# EAGLE design zumo_uni_i2c_01 (EAGLE 9.5.2)
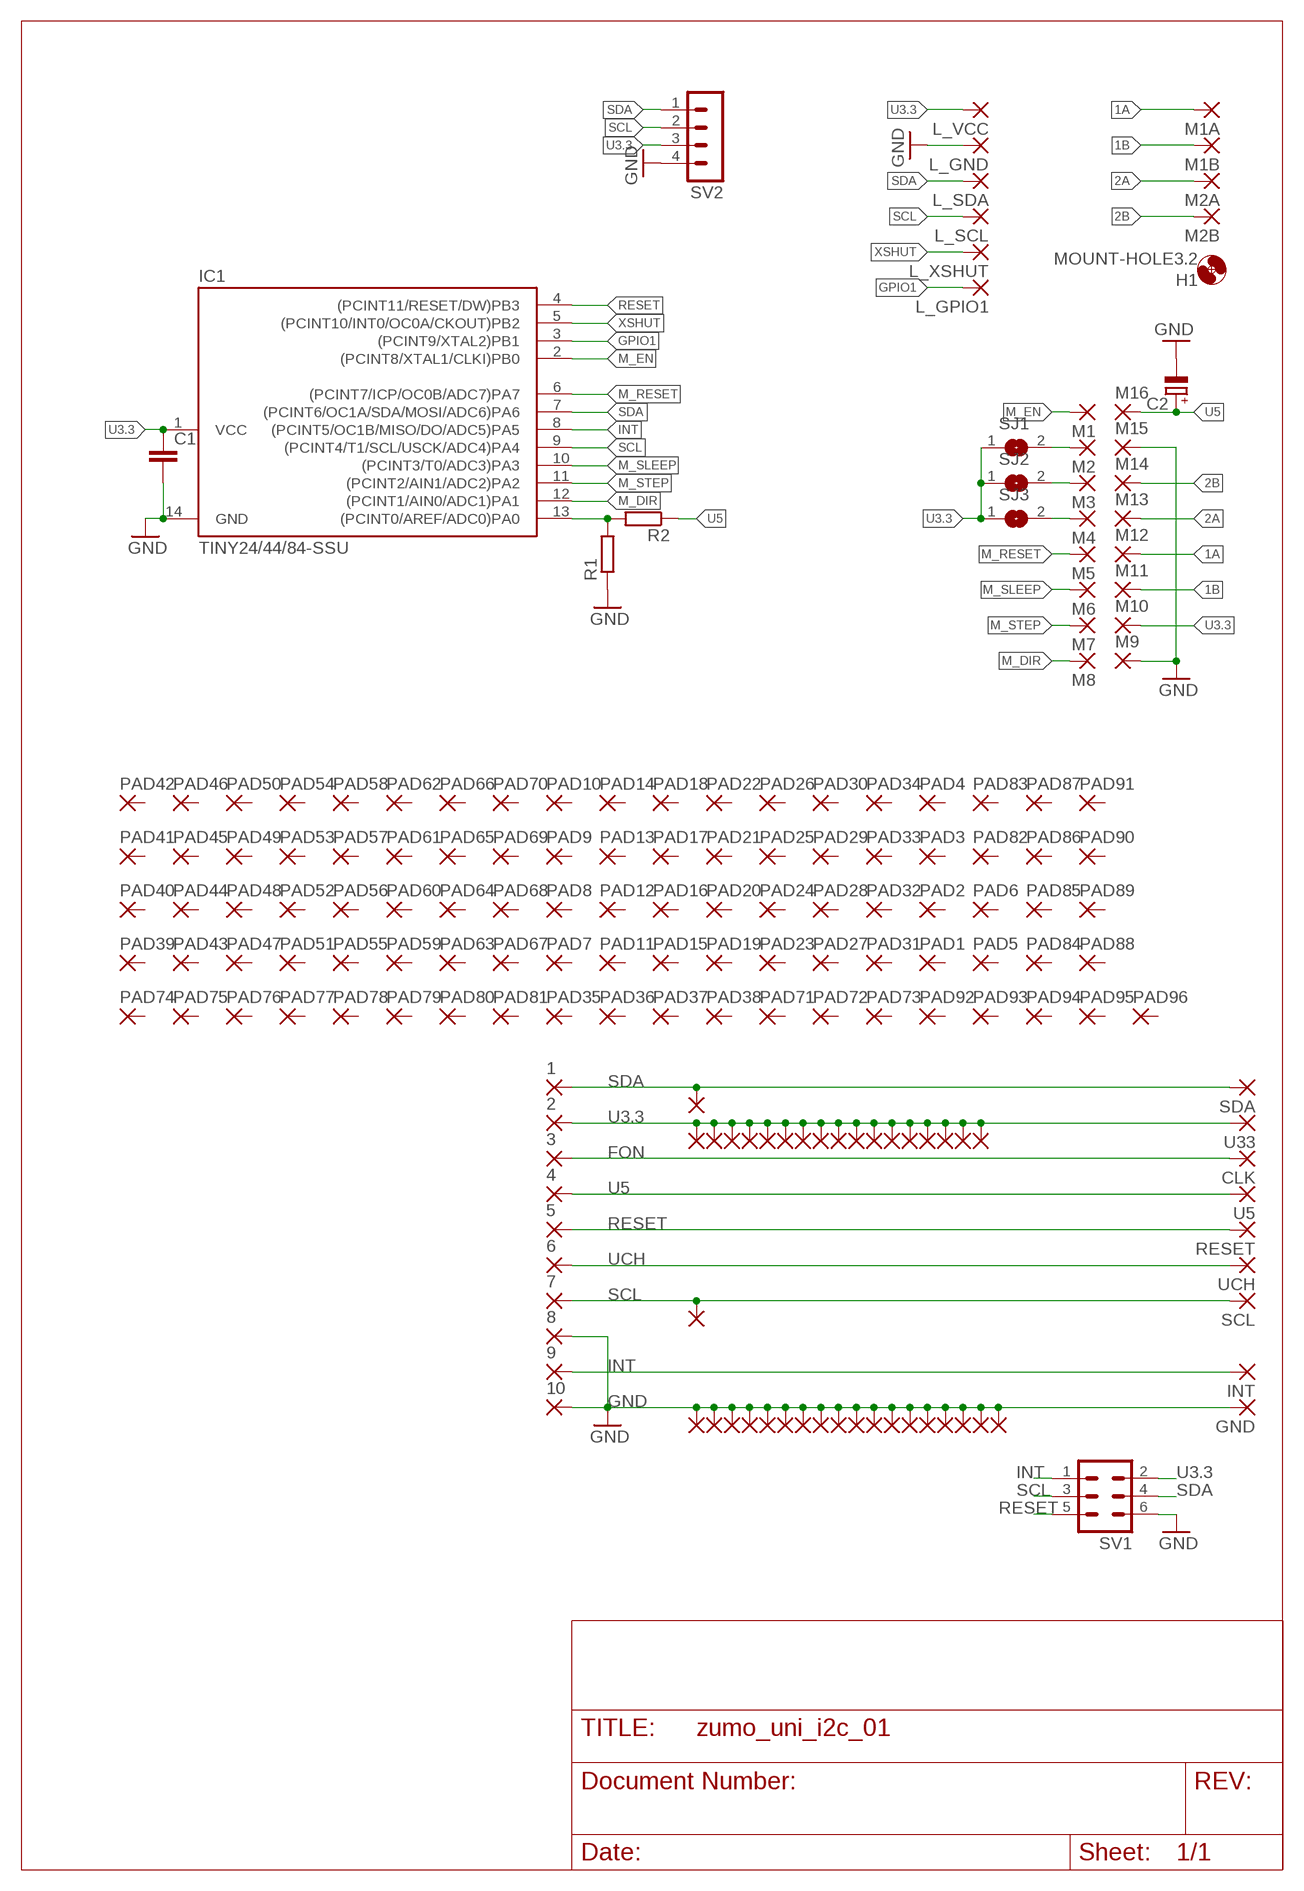
[diagram p0: schematic, sheet 1]

## Parts
1  SMD2  [SMD1,27-2,54]
2  SMD2  [SMD1,27-2,54]
3  SMD2  [SMD1,27-2,54]
4  SMD2  [SMD1,27-2,54]
5  SMD2  [SMD1,27-2,54]
6  SMD2  [SMD1,27-2,54]
7  SMD2  [SMD1,27-2,54]
8  SMD2  [SMD1,27-2,54]
9  SMD2  [SMD1,27-2,54]
10  SMD2  [SMD1,27-2,54]
C1  C-EUC0805  [C0805]
C2  CPOL-EUSMCC  [SMC_C]
CLK  1,6/0,9  [1,6/0,9]
GND  1,6/0,9  [1,6/0,9]
H1  MOUNT-HOLE3.2  [3,2]
IC1  TINY24/44/84-SSU  [SOIC14]
INT  1,6/0,9  [1,6/0,9]
L_GND  1,6/0,8  [1,6/0,8]
L_GPIO1  1,6/0,8  [1,6/0,8]
L_SCL  1,6/0,8  [1,6/0,8]
L_SDA  1,6/0,8  [1,6/0,8]
L_VCC  1,6/0,8  [1,6/0,8]
L_XSHUT  1,6/0,8  [1,6/0,8]
M1  1,6/0,9  [1,6/0,9]
M1A  1,6/0,8  [1,6/0,8]
M1B  1,6/0,8  [1,6/0,8]
M2  1,6/0,9  [1,6/0,9]
M2A  1,6/0,8  [1,6/0,8]
M2B  1,6/0,8  [1,6/0,8]
M3  1,6/0,9  [1,6/0,9]
M4  1,6/0,9  [1,6/0,9]
M5  1,6/0,9  [1,6/0,9]
M6  1,6/0,9  [1,6/0,9]
M7  1,6/0,9  [1,6/0,9]
M8  1,6/0,9  [1,6/0,9]
M9  1,6/0,9  [1,6/0,9]
M10  1,6/0,9  [1,6/0,9]
M11  1,6/0,9  [1,6/0,9]
M12  1,6/0,9  [1,6/0,9]
M13  1,6/0,9  [1,6/0,9]
M14  1,6/0,9  [1,6/0,9]
M15  1,6/0,9  [1,6/0,9]
M16  1,6/0,9  [1,6/0,9]
MISO1  1,6/0,9  [1,6/0,9]
MISO4  1,6/0,9  [1,6/0,9]
MISO5  1,6/0,9  [1,6/0,9]
MISO6  1,6/0,9  [1,6/0,9]
MISO7  1,6/0,9  [1,6/0,9]
MISO8  1,6/0,9  [1,6/0,9]
MISO9  1,6/0,9  [1,6/0,9]
MISO10  1,6/0,9  [1,6/0,9]
MISO11  1,6/0,9  [1,6/0,9]
MISO12  1,6/0,9  [1,6/0,9]
MISO13  1,6/0,9  [1,6/0,9]
MISO14  1,6/0,9  [1,6/0,9]
MISO15  1,6/0,9  [1,6/0,9]
MISO16  1,6/0,9  [1,6/0,9]
MISO17  1,6/0,9  [1,6/0,9]
MISO18  1,6/0,9  [1,6/0,9]
MISO19  1,6/0,9  [1,6/0,9]
MISO20  1,6/0,9  [1,6/0,9]
MISO21  1,6/0,9  [1,6/0,9]
MISO22  1,6/0,9  [1,6/0,9]
MISO23  1,6/0,9  [1,6/0,9]
MISO24  1,6/0,9  [1,6/0,9]
MISO25  1,6/0,9  [1,6/0,9]
MISO26  1,6/0,9  [1,6/0,9]
MISO27  1,6/0,9  [1,6/0,9]
MISO28  1,6/0,9  [1,6/0,9]
MISO29  1,6/0,9  [1,6/0,9]
MISO30  1,6/0,9  [1,6/0,9]
MISO31  1,6/0,9  [1,6/0,9]
MISO32  1,6/0,9  [1,6/0,9]
MISO33  1,6/0,9  [1,6/0,9]
MISO34  1,6/0,9  [1,6/0,9]
MISO35  1,6/0,9  [1,6/0,9]
MISO36  1,6/0,9  [1,6/0,9]
MISO37  1,6/0,9  [1,6/0,9]
MISO41  1,6/0,9  [1,6/0,9]
MISO43  1,6/0,9  [1,6/0,9]
PAD1  1,6/0,9  [1,6/0,9]
PAD2  1,6/0,9  [1,6/0,9]
PAD3  1,6/0,9  [1,6/0,9]
PAD4  1,6/0,9  [1,6/0,9]
PAD5  1,6/0,9  [1,6/0,9]
PAD6  1,6/0,9  [1,6/0,9]
PAD7  1,6/0,9  [1,6/0,9]
PAD8  1,6/0,9  [1,6/0,9]
PAD9  1,6/0,9  [1,6/0,9]
PAD10  1,6/0,9  [1,6/0,9]
PAD11  1,6/0,9  [1,6/0,9]
PAD12  1,6/0,9  [1,6/0,9]
PAD13  1,6/0,9  [1,6/0,9]
PAD14  1,6/0,9  [1,6/0,9]
PAD15  1,6/0,9  [1,6/0,9]
PAD16  1,6/0,9  [1,6/0,9]
PAD17  1,6/0,9  [1,6/0,9]
PAD18  1,6/0,9  [1,6/0,9]
PAD19  1,6/0,9  [1,6/0,9]
PAD20  1,6/0,9  [1,6/0,9]
PAD21  1,6/0,9  [1,6/0,9]
PAD22  1,6/0,9  [1,6/0,9]
PAD23  1,6/0,9  [1,6/0,9]
PAD24  1,6/0,9  [1,6/0,9]
PAD25  1,6/0,9  [1,6/0,9]
PAD26  1,6/0,9  [1,6/0,9]
PAD27  1,6/0,9  [1,6/0,9]
PAD28  1,6/0,9  [1,6/0,9]
PAD29  1,6/0,9  [1,6/0,9]
PAD30  1,6/0,9  [1,6/0,9]
PAD31  1,6/0,9  [1,6/0,9]
PAD32  1,6/0,9  [1,6/0,9]
PAD33  1,6/0,9  [1,6/0,9]
PAD34  1,6/0,9  [1,6/0,9]
PAD35  1,6/0,9  [1,6/0,9]
PAD36  1,6/0,9  [1,6/0,9]
PAD37  1,6/0,9  [1,6/0,9]
PAD38  1,6/0,9  [1,6/0,9]
PAD39  1,6/0,9  [1,6/0,9]
PAD40  1,6/0,9  [1,6/0,9]
PAD41  1,6/0,9  [1,6/0,9]
PAD42  1,6/0,9  [1,6/0,9]
PAD43  1,6/0,9  [1,6/0,9]
PAD44  1,6/0,9  [1,6/0,9]
PAD45  1,6/0,9  [1,6/0,9]
PAD46  1,6/0,9  [1,6/0,9]
PAD47  1,6/0,9  [1,6/0,9]
PAD48  1,6/0,9  [1,6/0,9]
PAD49  1,6/0,9  [1,6/0,9]
PAD50  1,6/0,9  [1,6/0,9]
PAD51  1,6/0,9  [1,6/0,9]
PAD52  1,6/0,9  [1,6/0,9]
PAD53  1,6/0,9  [1,6/0,9]
PAD54  1,6/0,9  [1,6/0,9]
PAD55  1,6/0,9  [1,6/0,9]
PAD56  1,6/0,9  [1,6/0,9]
PAD57  1,6/0,9  [1,6/0,9]
PAD58  1,6/0,9  [1,6/0,9]
PAD59  1,6/0,9  [1,6/0,9]
PAD60  1,6/0,9  [1,6/0,9]
PAD61  1,6/0,9  [1,6/0,9]
PAD62  1,6/0,9  [1,6/0,9]
PAD63  1,6/0,9  [1,6/0,9]
PAD64  1,6/0,9  [1,6/0,9]
PAD65  1,6/0,9  [1,6/0,9]
PAD66  1,6/0,9  [1,6/0,9]
PAD67  1,6/0,9  [1,6/0,9]
PAD68  1,6/0,9  [1,6/0,9]
PAD69  1,6/0,9  [1,6/0,9]
PAD70  1,6/0,9  [1,6/0,9]
PAD71  1,6/0,9  [1,6/0,9]
PAD72  1,6/0,9  [1,6/0,9]
PAD73  1,6/0,9  [1,6/0,9]
PAD74  1,6/0,9  [1,6/0,9]
PAD75  1,6/0,9  [1,6/0,9]
PAD76  1,6/0,9  [1,6/0,9]
PAD77  1,6/0,9  [1,6/0,9]
PAD78  1,6/0,9  [1,6/0,9]
PAD79  1,6/0,9  [1,6/0,9]
PAD80  1,6/0,9  [1,6/0,9]
PAD81  1,6/0,9  [1,6/0,9]
PAD82  1,6/0,9  [1,6/0,9]
PAD83  1,6/0,9  [1,6/0,9]
PAD84  1,6/0,9  [1,6/0,9]
PAD85  1,6/0,9  [1,6/0,9]
PAD86  1,6/0,9  [1,6/0,9]
PAD87  1,6/0,9  [1,6/0,9]
PAD88  1,6/0,9  [1,6/0,9]
PAD89  1,6/0,9  [1,6/0,9]
PAD90  1,6/0,9  [1,6/0,9]
PAD91  1,6/0,9  [1,6/0,9]
PAD92  1,6/0,9  [1,6/0,9]
PAD93  1,6/0,9  [1,6/0,9]
PAD94  1,6/0,9  [1,6/0,9]
PAD95  1,6/0,9  [1,6/0,9]
PAD96  1,6/0,9  [1,6/0,9]
R1  R-EU_M0805  [M0805]
R2  R-EU_M0805  [M0805]
RESET  1,6/0,9  [1,6/0,9]
SCL  1,6/0,9  [1,6/0,9]
SDA  1,6/0,9  [1,6/0,9]
SJ1  SJ  [SJ]
SJ2  SJ  [SJ]
SJ3  SJ  [SJ]
SV1  ML6  [ML6]
SV2  MA04-1  [MA04-1]
U5  1,6/0,9  [1,6/0,9]
U33  1,6/0,9  [1,6/0,9]
UCH  1,6/0,9  [1,6/0,9]

## Nets
1A: M1A.1(P) M12.1(P)
1B: M1B.1(P) M11.1(P)
2A: M2A.1(P) M13.1(P)
2B: M2B.1(P) M14.1(P)
FON: 3.1(P) CLK.1(P)
GND [gnd]: 8.1(P) 10.1(P) C1.2 C2.- GND.1(P) IC1.14(GND) L_GND.1(P) M9.1(P) M15.1(P) MISO1.1(P) MISO5.1(P) MISO6.1(P) MISO7.1(P) MISO8.1(P) MISO9.1(P) MISO10.1(P) MISO11.1(P) MISO12.1(P) MISO13.1(P) MISO14.1(P) MISO15.1(P) MISO16.1(P) MISO17.1(P) MISO18.1(P) MISO19.1(P) MISO20.1(P) MISO43.1(P) R1.1 SV1.6 SV2.4
GPIO1: IC1.3((PCINT9/XTAL2)PB1) L_GPIO1.1(P)
INT: 9.1(P) IC1.8((PCINT5/OC1B/MISO/DO/ADC5)PA5) INT.1(P) SV1.1
M_DIR: IC1.12((PCINT1/AIN0/ADC1)PA1) M8.1(P)
M_EN: IC1.2((PCINT8/XTAL1/CLKI)PB0) M1.1(P)
M_MS1: M2.1(P) SJ1.2
M_MS2: M3.1(P) SJ2.2
M_MS3: M4.1(P) SJ3.2
M_RESET: IC1.6((PCINT7/ICP/OC0B/ADC7)PA7) M5.1(P)
M_SLEEP: IC1.10((PCINT3/T0/ADC3)PA3) M6.1(P)
M_STEP: IC1.11((PCINT2/AIN1/ADC2)PA2) M7.1(P)
N$9: IC1.13((PCINT0/AREF/ADC0)PA0) R1.2 R2.2
RESET: 5.1(P) IC1.4((PCINT11/RESET/DW)PB3) RESET.1(P) SV1.5
SCL: 7.1(P) IC1.9((PCINT4/T1/SCL/USCK/ADC4)PA4) L_SCL.1(P) MISO41.1(P) SCL.1(P) SV1.3 SV2.2
SDA: 1.1(P) IC1.7((PCINT6/OC1A/SDA/MOSI/ADC6)PA6) L_SDA.1(P) MISO21.1(P) SDA.1(P) SV1.4 SV2.1
U3.3 [power]: 2.1(P) C1.1 IC1.1(VCC) L_VCC.1(P) M10.1(P) MISO4.1(P) MISO22.1(P) MISO23.1(P) MISO24.1(P) MISO25.1(P) MISO26.1(P) MISO27.1(P) MISO28.1(P) MISO29.1(P) MISO30.1(P) MISO31.1(P) MISO32.1(P) MISO33.1(P) MISO34.1(P) MISO35.1(P) MISO36.1(P) MISO37.1(P) SJ1.1 SJ2.1 SJ3.1 SV1.2 SV2.3 U33.1(P)
U5: 4.1(P) C2.+ M16.1(P) R2.1 U5.1(P)
UCH: 6.1(P) UCH.1(P)
XSHUT: IC1.5((PCINT10/INT0/OC0A/CKOUT)PB2) L_XSHUT.1(P)
Unconnected: PAD1.1(P) PAD2.1(P) PAD3.1(P) PAD4.1(P) PAD5.1(P) PAD6.1(P) PAD7.1(P) PAD8.1(P) PAD9.1(P) PAD10.1(P) PAD11.1(P) PAD12.1(P) PAD13.1(P) PAD14.1(P) PAD15.1(P) PAD16.1(P) PAD17.1(P) PAD18.1(P) PAD19.1(P) PAD20.1(P) PAD21.1(P) PAD22.1(P) PAD23.1(P) PAD24.1(P) PAD25.1(P) PAD26.1(P) PAD27.1(P) PAD28.1(P) PAD29.1(P) PAD30.1(P) PAD31.1(P) PAD32.1(P) PAD33.1(P) PAD34.1(P) PAD35.1(P) PAD36.1(P) PAD37.1(P) PAD38.1(P) PAD39.1(P) PAD40.1(P) PAD41.1(P) PAD42.1(P) PAD43.1(P) PAD44.1(P) PAD45.1(P) PAD46.1(P) PAD47.1(P) PAD48.1(P) PAD49.1(P) PAD50.1(P) PAD51.1(P) PAD52.1(P) PAD53.1(P) PAD54.1(P) PAD55.1(P) PAD56.1(P) PAD57.1(P) PAD58.1(P) PAD59.1(P) PAD60.1(P) PAD61.1(P) PAD62.1(P) PAD63.1(P) PAD64.1(P) PAD65.1(P) PAD66.1(P) PAD67.1(P) PAD68.1(P) PAD69.1(P) PAD70.1(P) PAD71.1(P) PAD72.1(P) PAD73.1(P) PAD74.1(P) PAD75.1(P) PAD76.1(P) PAD77.1(P) PAD78.1(P) PAD79.1(P) PAD80.1(P) PAD81.1(P) PAD82.1(P) PAD83.1(P) PAD84.1(P) PAD85.1(P) PAD86.1(P) PAD87.1(P) PAD88.1(P) PAD89.1(P) PAD90.1(P) PAD91.1(P) PAD92.1(P) PAD93.1(P) PAD94.1(P) PAD95.1(P) PAD96.1(P)

## Library data of the parts
1-10 = wirepad:SMD2: SMD PAD
C1 = rcl:C-EU: CAPACITOR, European symbol; SPICEPREFIX: C
C2 = rcl:CPOL-EU: POLARIZED CAPACITOR, European symbol; SPICEPREFIX: C
CLK GND INT M1-M16 MISO1 MISO4-MISO37 MISO41 MISO43 PAD1-PAD96 RESET SCL SDA U5 U33 UCH = wirepad:1,6/0,9: THROUGH-HOLE PAD
H1 = holes:MOUNT-HOLE: MOUNTING HOLE with drill center marker
IC1 = avr-7:TINY24/44/84
L_GND L_GPIO1 L_SCL L_SDA L_VCC L_XSHUT M1A M1B M2A M2B = wirepad:1,6/0,8: THROUGH-HOLE PAD
R1 R2 = rcl:R-EU_: RESISTOR, European symbol; SPICEPREFIX: R
SJ1-SJ3 = jumper:SJ: SMD solder JUMPER
SV1 = con-harting-ml:ML6: HARTING; OC_FARNELL: unknown; OC_NEWARK: unknown
SV2 = con-lstb:MA04-1: PIN HEADER; OC_FARNELL: unknown; OC_NEWARK: unknown

## Net classes
1 gnd: width 0.381 mm, drill 0.381 mm
2 power: width 0.381 mm, drill 0.381 mm

## Board
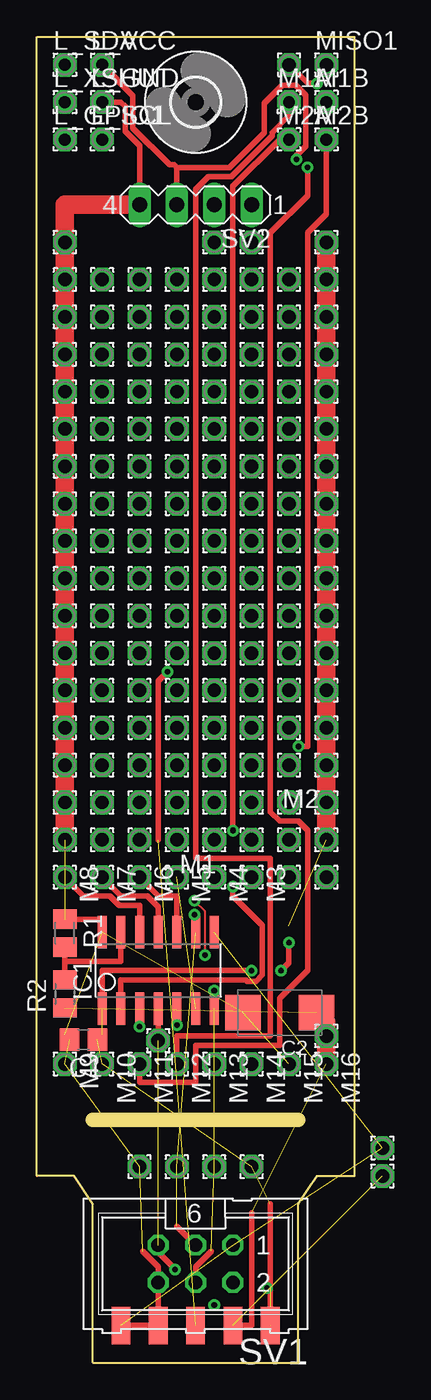
[diagram p1: board, top side]
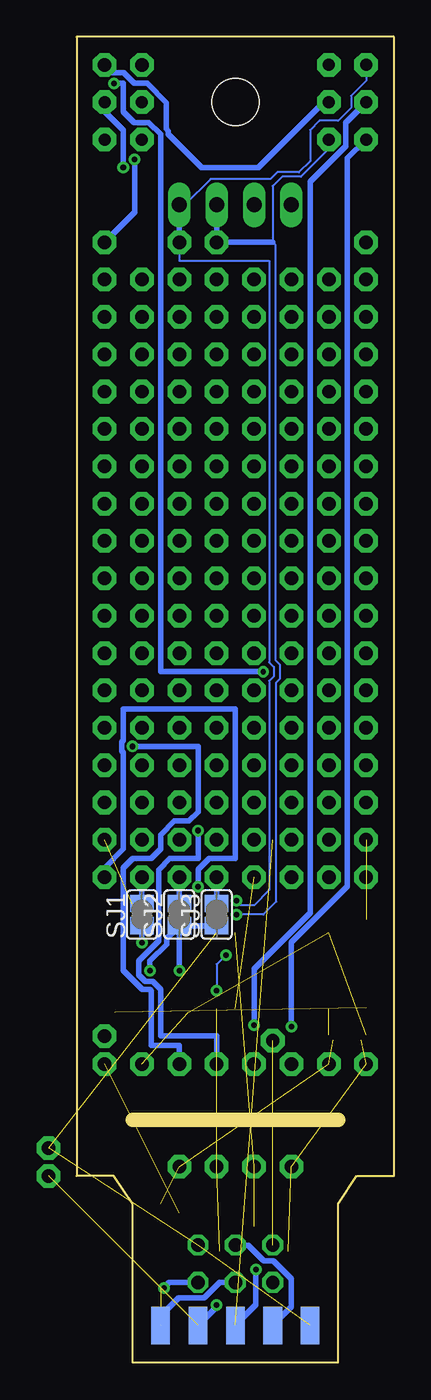
[diagram p2: board, bottom side, seen from below]

Size 21.59 x 90.17 mm. Coordinates in mm from the lower left corner, seen from the top.
Outline: 3.81,0 3.81,10.79 2.54,12.7 0,12.7 0,90.17 21.59,90.17 21.59,12.7 19.05,12.7 17.78,10.79 17.78,0 3.81,0
Copper layers (1*16): Top 0.035mm / dielectric 1.5mm / Bottom 0.035mm
Design rules "default": minimum track width 6mil, minimum drill 0.35mm, track to track 6mil, track to pad 6mil, pad to pad 6mil, via to via 6mil, smd to smd 6mil, copper to edge 40mil, drill to drill 6mil, minimum pad ring 10mil, minimum via ring 8mil, stop-mask expansion 4mil, vias tented up to drill 0mil, thermal gap 10mil
Milling: 1 lines

### Footprints (pad centres in the part's own frame; a part is rotated, then mirrored left to right if it is on the bottom)
SMD1,27-2,54 = smd 1.27 x 2.54: 1 0,0
C0805 = smd 1.3 x 1.5: 1 -0.95,0; 2 0.95,0
SMC_C = smd 2.4 x 2.4: + -2.5,0; - 2.5,0
1,6/0,9 = drill 0.914 pad 1.6 octagon: 1 0,0
3,2 = hole 3.2: 0,0
SOIC14 = smd 0.61 x 2.21: 1 -3.81,-2.603; 2 -2.54,-2.603; 3 -1.27,-2.603; 4 0,-2.603; 5 1.27,-2.603; 6 2.54,-2.603; 7 3.81,-2.603; 8 3.81,2.603; 9 2.54,2.603; 10 1.27,2.603; 11 0,2.603; 12 -1.27,2.603; 13 -2.54,2.603; 14 -3.81,2.603
1,6/0,8 = drill 0.813 pad 1.6 octagon: 1 0,0
M0805 = smd 1.3 x 1.6: 1 -0.95,0; 2 0.95,0
SJ = smd 1.168 x 1.6: 1 -0.762,0; 2 0.762,0
ML6 = drill 0.914 octagon: 1 -2.54,-1.27; 2 -2.54,1.27; 3 0,-1.27; 4 0,1.27; 5 2.54,-1.27; 6 2.54,1.27
MA04-1 = drill 1.016 long: 1 -3.81,0; 2 -1.27,0; 3 1.27,0; 4 3.81,0

### Placement (x,y rotation side)
1  15.88,2.54 0 bottom
2  15.88,2.54 0 top
3  13.34,2.54 0 bottom
4  13.34,2.54 0 top
5  10.79,2.54 0 bottom
6  10.79,2.54 0 top
7  8.26,2.54 0 bottom
8  8.26,2.54 0 top
9  5.71,2.54 0 bottom
10  5.71,2.54 0 top
C1  3.17,21.97 180 top
C2  16.51,23.81 180 top
CLK  23.49,12.7 0 top
GND  1.91,35.56 0 top
H1  10.79,85.72 0 top
IC1  8.26,26.67 0 top
INT  23.49,14.61 0 top
L_GND  4.44,85.72 0 top
L_GPIO1  1.91,83.19 0 top
L_SCL  4.44,83.19 0 top
L_SDA  1.91,88.27 0 top
L_VCC  4.44,88.27 0 top
L_XSHUT  1.91,85.72 0 top
M1  19.68,33.02 180 top
M1A  17.14,85.72 0 top
M1B  19.68,85.72 0 top
M2  17.14,33.02 180 top
M2A  17.14,83.19 0 top
M2B  19.68,83.19 0 top
M3  14.61,33.02 270 top
M4  12.07,33.02 270 top
M5  9.53,33.02 270 top
M6  6.99,33.02 270 top
M7  4.44,33.02 270 top
M8  1.91,33.02 270 top
M9  1.91,20.32 270 top
M10  4.44,20.32 270 top
M11  6.99,20.32 270 top
M12  9.53,20.32 270 top
M13  12.07,20.32 270 top
M14  14.61,20.32 270 top
M15  17.14,20.32 270 top
M16  19.68,20.32 270 top
MISO1  19.68,88.27 0 top
MISO4  19.68,38.1 0 top
MISO5  1.91,50.8 0 top
MISO6  1.91,55.88 0 top
MISO7  1.91,45.72 0 top
MISO8  1.91,53.34 0 top
MISO9  1.91,60.96 0 top
MISO10  1.91,58.42 0 top
MISO11  1.91,63.5 0 top
MISO12  1.91,68.58 0 top
MISO13  1.91,73.66 0 top
MISO14  1.91,71.12 0 top
MISO15  1.91,76.2 0 top
MISO16  1.91,48.26 0 top
MISO17  1.91,43.18 0 top
MISO18  1.91,40.64 0 top
MISO19  1.91,38.1 0 top
MISO20  1.91,66.04 0 top
MISO21  12.07,13.33 0 top
MISO22  19.68,35.56 0 top
MISO23  19.68,43.18 0 top
MISO24  19.68,45.72 0 top
MISO25  19.68,48.26 0 top
MISO26  19.68,50.8 0 top
MISO27  19.68,53.34 0 top
MISO28  19.68,55.88 0 top
MISO29  19.68,58.42 0 top
MISO30  19.68,60.96 0 top
MISO31  19.68,63.5 0 top
MISO32  19.68,66.04 0 top
MISO33  19.68,68.58 0 top
MISO34  19.68,71.12 0 top
MISO35  19.68,73.66 0 top
MISO36  19.68,76.2 0 top
MISO37  14.61,13.33 0 top
MISO41  12.07,76.2 0 top
MISO43  6.99,13.33 0 top
PAD1  17.14,53.34 0 top
PAD2  17.14,63.5 0 top
PAD3  6.99,71.12 0 top
PAD4  6.99,73.66 0 top
PAD5  9.53,73.66 0 top
PAD6  17.14,66.04 0 top
PAD7  17.14,71.12 0 top
PAD8  17.14,38.1 0 top
PAD9  17.14,35.56 0 top
PAD10  4.44,71.12 0 top
PAD11  12.07,35.56 0 top
PAD12  4.44,35.56 0 top
PAD13  6.99,35.56 0 top
PAD14  9.53,35.56 0 top
PAD15  4.44,38.1 0 top
PAD16  6.99,38.1 0 top
PAD17  9.53,38.1 0 top
PAD18  12.07,38.1 0 top
PAD19  4.44,40.64 0 top
PAD20  6.99,40.64 0 top
PAD21  12.07,40.64 0 top
PAD22  9.53,40.64 0 top
PAD23  4.44,43.18 0 top
PAD24  6.99,43.18 0 top
PAD25  9.53,43.18 0 top
PAD26  12.07,43.18 0 top
PAD27  4.44,45.72 0 top
PAD28  6.99,45.72 0 top
PAD29  9.53,45.72 0 top
PAD30  12.07,45.72 0 top
PAD31  4.44,48.26 0 top
PAD32  6.99,48.26 0 top
PAD33  9.53,48.26 0 top
PAD34  12.07,48.26 0 top
PAD35  4.44,73.66 0 top
PAD36  14.61,38.1 0 top
PAD37  14.61,40.64 0 top
PAD38  14.61,35.56 0 top
PAD39  4.44,50.8 0 top
PAD40  6.99,50.8 0 top
PAD41  9.53,50.8 0 top
PAD42  12.07,50.8 0 top
PAD43  4.44,53.34 0 top
PAD44  6.99,53.34 0 top
PAD45  9.53,53.34 0 top
PAD46  12.07,53.34 0 top
PAD47  4.44,55.88 0 top
PAD48  6.99,55.88 0 top
PAD49  9.53,55.88 0 top
PAD50  12.07,55.88 0 top
PAD51  4.44,58.42 0 top
PAD52  6.99,58.42 0 top
PAD53  9.53,58.42 0 top
PAD54  12.07,58.42 0 top
PAD55  4.44,60.96 0 top
PAD56  6.99,60.96 0 top
PAD57  12.07,60.96 0 top
PAD58  4.44,63.5 0 top
PAD59  9.53,60.96 0 top
PAD60  6.99,63.5 0 top
PAD61  4.44,68.58 0 top
PAD62  6.99,68.58 0 top
PAD63  9.53,63.5 0 top
PAD64  4.44,66.04 0 top
PAD65  12.07,66.04 0 top
PAD66  9.53,68.58 0 top
PAD67  12.07,63.5 0 top
PAD68  6.99,66.04 0 top
PAD69  9.53,66.04 0 top
PAD70  12.07,68.58 0 top
PAD71  14.61,48.26 0 top
PAD72  14.61,43.18 0 top
PAD73  14.61,55.88 0 top
PAD74  14.61,50.8 0 top
PAD75  14.61,45.72 0 top
PAD76  14.61,60.96 0 top
PAD77  14.61,58.42 0 top
PAD78  14.61,53.34 0 top
PAD79  14.61,63.5 0 top
PAD80  14.61,68.58 0 top
PAD81  14.61,66.04 0 top
PAD82  17.14,40.64 0 top
PAD83  17.14,43.18 0 top
PAD84  17.14,73.66 0 top
PAD85  14.61,73.66 0 top
PAD86  17.14,50.8 0 top
PAD87  17.14,45.72 0 top
PAD88  12.07,73.66 0 top
PAD89  12.07,71.12 0 top
PAD90  17.14,48.26 0 top
PAD91  17.14,58.42 0 top
PAD92  17.14,55.88 0 top
PAD93  14.61,71.12 0 top
PAD94  17.14,60.96 0 top
PAD95  9.53,71.12 0 top
PAD96  17.14,68.58 0 top
R1  1.91,29.21 270 top
R2  1.91,25.08 90 top
RESET  8.26,21.91 0 top
SCL  9.53,13.33 0 top
SDA  14.61,76.2 0 top
SJ1  17.14,30.48 90 bottom
SJ2  14.61,30.48 90 bottom
SJ3  12.07,30.48 90 bottom
SV1  10.79,6.73 180 top
SV2  10.79,78.74 180 top
U5  19.68,22.22 0 top
U33  19.68,40.64 0 top
UCH  17.14,88.27 0 top

### Tracks (layer width: path | path; a pad name or v marks a point on that pad's centre or on a via)
1A
  Top 0.381: M12.1 9.53,22.22 15.88,22.22 15.88,34.29 10.79,34.29 10.79,79.8 11.65,80.64 13.22,80.64 16,83.43 16,83.66 17.14,84.8 M1A.1
1B  (via drill 0.38)
  Top 0.381: M11.1 6.99,19.05 10.79,19.05 10.79,21.59 16.51,21.59 16.51,24.77 18.41,26.67 18.41,36.2 17.78,36.83 16.51,36.83 15.88,37.47 15.88,76.83 18.41,79.38 v18.41,81.28
  Bottom 0.381: M1B.1 19.68,85.09 18.41,83.82 v18.41,81.28
2A  (via drill 0.38)
  Top 0.381: v13.34,36.19 13.34,80.01 16.51,83.19 M2A.1
  Bottom 0.381: M13.1 12.07,22.22 15.88,22.22 15.88,25.4 16.41,25.93 16.92,25.93 17.35,26.36 17.35,27.33 16,28.68 16,33.53 15.24,34.29 13.34,34.29 v13.34,36.19
2B  (via drill 0.38)
  Top 0.381: v17.78,41.91 18.41,41.91 18.41,76.83 19.68,78.1 M2B.1
  Bottom 0.381: M14.1 14.61,21.59 16.51,21.59 16.51,25.28 16.63,25.4 17.14,25.4 17.77,26.04 17.78,26.04 18.41,26.67 18.41,33.66 17.78,34.29 16.51,34.29 15.88,34.93 15.88,35.91 14.95,36.83 13.97,36.83 13.34,37.47 13.34,41.91 v17.78,41.91
FON  (via drill 0.38)  (1 unrouted)
  Bottom 0.381: 3.1 12.07,3.81 v12.07,3.94
GND  (7 unrouted)
  Top 0.381: 10.1 8.1 SV1.6 8.26,6.51 7.2,7.56 | 1.91,22.29 C1.2 | R1.1 4.13,30.16 4.44,29.84 IC1.14 | L_GND.1 5.71,85.72 6.01,85.43 6.01,83.74 6.99,82.76 SV2.4
  Top 1.27: GND.1 MISO19.1 MISO18.1 MISO17.1 MISO7.1 MISO16.1 MISO5.1 MISO8.1 MISO6.1 MISO10.1 MISO9.1 MISO11.1 MISO20.1 MISO12.1 MISO14.1 MISO13.1 MISO15.1 1.91,78.74 SV2.4
  Bottom 0.381: MISO1.1 19.15,87.73 18.4,87.73 17.66,86.99 16.8,86.99 15.49,85.69 15.49,83.91 15.34,83.75 15.34,83.54 13.08,81.28 9.22,81.28 4.78,85.72 L_GND.1
GPIO1  (via drill 0.38)
  Top 0.381: v6.99,22.86 IC1.3
  Bottom 0.381: L_GPIO1.1 3.17,81.91 3.17,32.38 6.99,28.57 v6.99,22.86
INT  (3 unrouted)
M_DIR
  Top 0.381: M8.1 3.17,31.75 4.96,31.75 5.6,31.11 6.99,31.11 IC1.12
M_EN  (via drill 0.38)
  Top 0.381: IC1.2 5.71,26.04 14.2,26.04 14.3,25.93 14.91,25.93 15.34,26.36 15.34,29.74 13.34,31.75 v13.34,32.38
  Bottom 0.381: v13.34,32.38 13.34,33.54 12.58,34.29 10.79,34.29 10.79,44.45 18.41,44.45 18.41,42.32 18.52,42.22 18.52,41.61 18.41,41.5 18.41,34.93 19.68,33.66 M1.1
M_MS1
  Bottom 0.381: M2.1 SJ1.2
M_MS2
  Bottom 0.381: M3.1 SJ2.2
M_MS3
  Bottom 0.381: M4.1 SJ3.2
M_RESET  (1 unrouted)
M_SLEEP
  Top 0.381: M6.1 8.26,31.75 9.53,31.75 IC1.10
M_STEP
  Top 0.381: M7.1 5.71,31.75 7.5,31.75 8.26,31 IC1.11
N$9
  Top 0.381: 1.91,27.3 5.71,27.3 IC1.13 | 1.91,27.3 R1.2 | R2.2 1.91,27.3
RESET  (via drill 0.38)  (1 unrouted)
  Top 0.381: v9.4,6.35 8.26,7.49 SV1.5 | IC1.4 RESET.1
  Bottom 0.381: 5.1 9.4,3.94 v9.4,6.35
SCL  (via drill 0.38)  (2 unrouted)
  Top 0.152: v10.72,30.48 10.79,30.4 IC1.9
  Top 0.381: SV1.3 9.53,9.27
  Bottom 0.152: v10.72,30.48 8.89,30.48 8.01,31.36 8.01,46.27 7.75,46.54 7.75,47.44 8.07,47.76 8.07,76.01 8.26,76.2 8.26,80.01 7.62,80.64 6.35,80.64 4.44,82.55 L_SCL.1
  Bottom 0.381: SV1.3 9.91,8 8.85,6.95 8.22,6.95 6.99,5.71 6.99,3.81 7.1 | SV2.2 MISO41.1 8.26,76.2
SDA  (via drill 0.38)  (3 unrouted)
  Top 0.152: v10.72,31.42 11.43,30.71 v11.43,27.73 | v12.07,25.3 IC1.7
  Top 0.381: SV1.4 10.79,6.51 11.85,7.56
  Bottom 0.152: SDA.1 14.61,74.93 8.5,74.93 8.5,47.63 8.18,47.32 8.18,46.68 8.5,46.37 8.5,32.14 9.53,31.11 10.41,31.11 v10.72,31.42 | v11.43,27.73 12.07,27.09 v12.07,25.3 | L_SDA.1 1.91,87.18 2.93,86.15 2.93,85.33 3.81,84.45 5.08,84.45 5.71,83.82 5.71,81.71 6.48,80.95 7.95,80.95 8.41,80.49 12.48,80.49 14.23,78.74 SV2.1
  Bottom 0.381: SV1.4 11.84,5.46 12.9,4.41 14.64,4.41 15.86,3.19 15.86,2.55 | SDA.1 SV2.1
U3.3  (via drill 0.38)  (6 unrouted)
  Top 0.381: 15.86,5.08 v15.66,5.08 15.86,5.28 15.86,6.35 | 15.88,10.79 2.1 15.88,3.81 | v17.14,28.57 17.14,27.2 v16.61,26.67 | 4.44,22.29 C1.1 | IC1.1 4.44,26.67 v14.61,26.67 | SV2.3 9.53,81.28 | L_VCC.1 6.54,86.17 6.54,83.96 9.03,81.47 9.33,81.47 9.53,81.28 | v17.64,81.84 17.64,82.07 18.29,82.71 18.29,86.2 17.62,86.87 16.67,86.87 15.47,85.66 15.47,83.65 13.1,81.28 9.53,81.28
  Top 1.27: MISO36.1 MISO35.1 MISO34.1 MISO33.1 MISO32.1 MISO31.1 MISO30.1 MISO29.1 MISO28.1 MISO27.1 MISO26.1 MISO25.1 MISO24.1 MISO23.1 U33.1 MISO4.1 MISO22.1
  Bottom 0.381: SV1.2 15.28,5.46 v15.66,5.08 | SJ3.1 SJ2.1 | SJ1.1 v17.14,28.57 | SJ2.1 15.47,28.85 15.47,28.45 16.61,27.31 v16.61,26.67 | v14.61,26.67 SJ2.1 | MISO36.1 17.64,78.24 v17.64,81.84
U5  (2 unrouted)
  Top 0.381: 4.1 14.61,2.54 14.61,10.2
  Top 1.27: C2.+ 19.68,23.14 U5.1 M16.1
UCH  (via drill 0.35, 0.38)  (1 unrouted)
  Top 0.381: v8.89,46.99 8.26,46.36 8.26,35.56 | v19.05,86.99 18.41,86.99 UCH.1
  Bottom 0.381: v8.89,46.99 15.88,46.99 15.88,83.53 16.67,84.33 17.65,84.33 18.41,85.09 18.41,86.99 v19.05,86.99
XSHUT  (via drill 0.38)
  Top 0.381: v9.53,22.96 IC1.5
  Bottom 0.381: L_XSHUT.1 3.3,84.33 3.3,82.71 5.71,80.3 5.71,30.6 9.53,26.79 v9.53,22.96